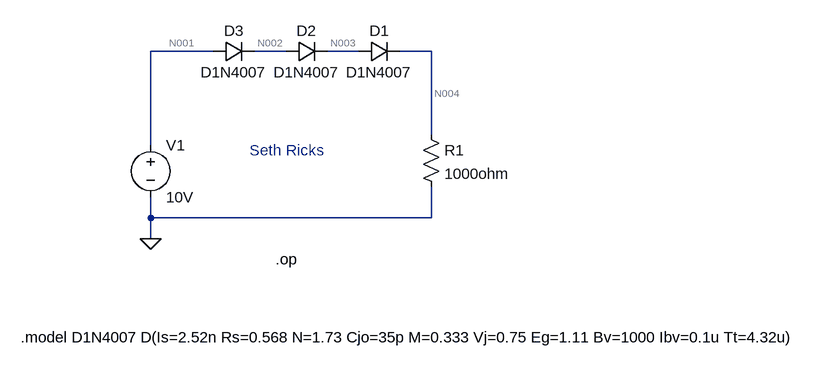
[diagram p0: schematic DiodesHW1.asc]
DiodesHW1.asc, the LTspice schematic file:
Version 4
SHEET 1 904 680
WIRE -176 -80 -272 -80
WIRE -64 -80 -112 -80
WIRE 48 -80 0 -80
WIRE 160 -80 112 -80
WIRE 160 48 160 -80
WIRE -272 64 -272 -80
WIRE -272 176 -272 144
WIRE 160 176 160 128
WIRE 160 176 -272 176
WIRE -272 208 -272 176
FLAG -272 208 0
SYMBOL res 144 32 R0
SYMATTR InstName R1
SYMATTR Value 1000ohm
SYMBOL diode 48 -64 R270
WINDOW 0 32 32 VTop 2
WINDOW 3 0 32 VBottom 2
SYMATTR InstName D1
SYMATTR Value D1N4007
SYMBOL voltage -272 48 R0
SYMATTR InstName V1
SYMATTR Value 10V
SYMBOL diode -64 -64 R270
WINDOW 0 32 32 VTop 2
WINDOW 3 0 32 VBottom 2
SYMATTR InstName D2
SYMATTR Value D1N4007
SYMBOL diode -176 -64 R270
WINDOW 0 32 32 VTop 2
WINDOW 3 0 32 VBottom 2
SYMATTR InstName D3
SYMATTR Value D1N4007
TEXT -472 360 Left 2 !.model D1N4007 D(Is=2.52n Rs=0.568 N=1.73 Cjo=35p M=0.333 Vj=0.75 Eg=1.11 Bv=1000 Ibv=0.1u Tt=4.32u)
TEXT -80 240 Left 2 !.op
TEXT -120 72 Left 2 ;Seth Ricks

The netlist it stands for:
* DiodesHW1.asc
R1 N004 0 1000ohm
D1 N003 N004 D1N4007
V1 N001 0 10V
D2 N002 N003 D1N4007
D3 N001 N002 D1N4007
.model D D
.lib standard.dio
.model D1N4007 D(Is=2.52n Rs=0.568 N=1.73 Cjo=35p M=0.333 Vj=0.75 Eg=1.11 Bv=1000 Ibv=0.1u Tt=4.32u)
.op
* Seth Ricks
.backanno
.end

* Results of the author's LTspice run, read from the files saved beside the schematic
* Operating Point:
*   V(n004) = 7.977 V
*   V(n003) = 8.651 V
*   V(n001) = 10 V
*   V(n002) = 9.326 V
*   I(D3) = 7.977 mA
*   I(D2) = 7.977 mA
*   I(D1) = 7.977 mA
*   I(R1) = 7.977 mA
*   I(V1) = -7.977 mA
* From the log:
*   Semiconductor Device Operating Points:
*                           --- Diodes ---
*   Name:      d3          d2          d1
*   Model:   d1n4007     d1n4007     d1n4007
*   Id:      7.98e-03    7.98e-03    7.98e-03
*   Vd:      6.74e-01    6.74e-01    6.74e-01
*   Req:     5.61e+00    5.61e+00    5.61e+00
*   CAP:     7.70e-07    7.70e-07    7.70e-07